# EAGLE design Rx (EAGLE 9.6.2)
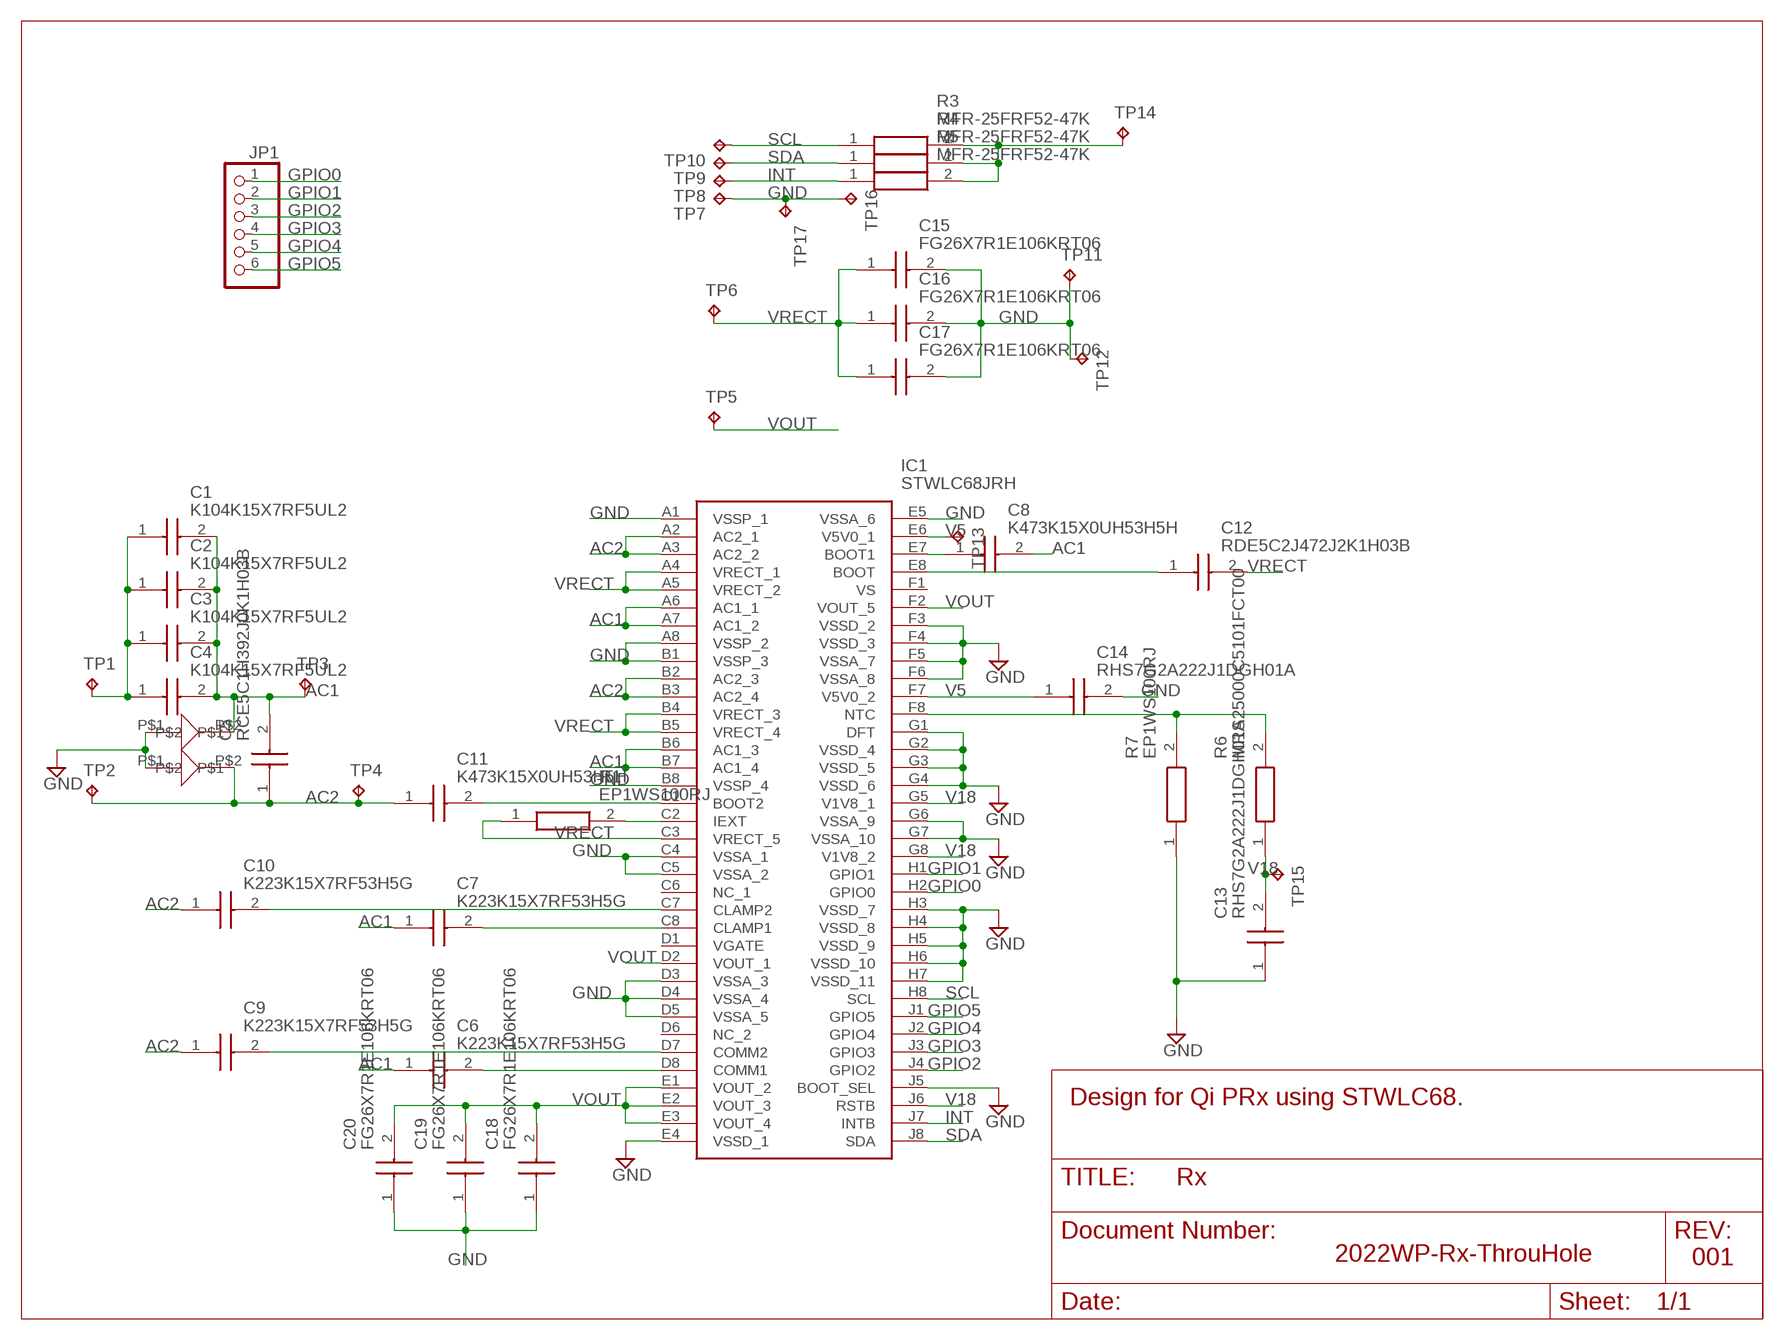
[diagram p0: schematic, sheet 1]

## Parts
C1  K104K15X7RF5UL2  [K104K15X7RF5UL2]
C2  K104K15X7RF5UL2  [K104K15X7RF5UL2]
C3  K104K15X7RF5UL2  [K104K15X7RF5UL2]
C4  K104K15X7RF5UL2  [K104K15X7RF5UL2]
C5  RCE5C1H392J0K1H03B  [RCER71H104K0K1H03B]
C6  K223K15X7RF53H5G  [K223K15X7RF53H5G]
C7  K223K15X7RF53H5G  [K223K15X7RF53H5G]
C8  K473K15X0UH53H5H  [K473K15X0UH53H5H]
C9  K223K15X7RF53H5G  [K223K15X7RF53H5G]
C10  K223K15X7RF53H5G  [K223K15X7RF53H5G]
C11  K473K15X0UH53H5H  [K473K15X0UH53H5H]
C12  RDE5C2J472J2K1H03B  [RCE5C1H104J2A2H03B]
C13  RHS7G2A222J1DGH01A  [RHS7G2A182J1A2H01B]
C14  RHS7G2A222J1DGH01A  [RHS7G2A182J1A2H01B]
C15  FG26X7R1E106KRT06  [FG26]
C16  FG26X7R1E106KRT06  [FG26]
C17  FG26X7R1E106KRT06  [FG26]
C18  FG26X7R1E106KRT06  [FG26]
C19  FG26X7R1E106KRT06  [FG26]
C20  FG26X7R1E106KRT06  [FG26]
IC1  STWLC68JRH  [BGA72C40P9X9_441X376X58]
JP1  PINHD-1X6  [1X06]
R1  EP1WS100RJ  [RESAD2400W54L1000D350]
R3  MFR-25FRF52-47K  [RESAD1590W60L630D240]
R4  MFR-25FRF52-47K  [RESAD1590W60L630D240]
R5  MFR-25FRF52-47K  [RESAD1590W60L630D240]
R6  MRS25000C5101FCT00  [RESAD1650W60L650D250]
R7  EP1WS100RJ  [RESAD2400W54L1000D350]
TP1  TPPAD1-13  [P1-13]
TP2  TPPAD1-13  [P1-13]
TP3  TPPAD1-13  [P1-13]
TP4  TPPAD1-13  [P1-13]
TP5  TPPAD1-13  [P1-13]
TP6  TPPAD1-13  [P1-13]
TP7  TPPAD1-13  [P1-13]
TP8  TPPAD1-13  [P1-13]
TP9  TPPAD1-13  [P1-13]
TP10  TPPAD1-13  [P1-13]
TP11  TPPAD1-13  [P1-13]
TP12  TPPAD1-13  [P1-13]
TP13  TPPAD1-13  [P1-13]
TP14  TPPAD1-13  [P1-13]
TP15  TPPAD1-13  [P1-13]
TP16  TPPAD1-13  [P1-13]
TP17  TPPAD1-13  [P1-13]
U$1  SA16A-E3/54  [SA16A-E3/54]
U$2  SA16A-E3/54  [SA16A-E3/54]

## Nets
AC1: C1.2 C2.2 C3.2 C4.2 C5.2 C6.1 C7.1 C8.2 IC1.A6(AC1_1) IC1.A7(AC1_2) IC1.B6(AC1_3) IC1.B7(AC1_4) TP3.TP U$1.P$2
AC2: C5.1 C9.1 C10.1 C11.1 IC1.A2(AC2_1) IC1.A3(AC2_2) IC1.B2(AC2_3) IC1.B3(AC2_4) TP2.TP TP4.TP U$2.P$2
GND: C13.1 C14.2 C15.2 C16.2 C17.2 C18.1 C19.1 C20.1 IC1.A1(VSSP_1) IC1.A8(VSSP_2) IC1.B1(VSSP_3) IC1.B8(VSSP_4) IC1.C4(VSSA_1) IC1.C5(VSSA_2) IC1.D3(VSSA_3) IC1.D4(VSSA_4) IC1.D5(VSSA_5) IC1.E4(VSSD_1) IC1.E5(VSSA_6) IC1.F3(VSSD_2) IC1.F4(VSSD_3) IC1.F5(VSSA_7) IC1.F6(VSSA_8) IC1.G1(DFT) IC1.G2(VSSD_4) IC1.G3(VSSD_5) IC1.G4(VSSD_6) IC1.G6(VSSA_9) IC1.G7(VSSA_10) IC1.H3(VSSD_7) IC1.H4(VSSD_8) IC1.H5(VSSD_9) IC1.H6(VSSD_10) IC1.H7(VSSD_11) IC1.J5(BOOT_SEL) R7.1 TP7.TP TP11.TP TP12.TP TP16.TP TP17.TP U$1.P$1 U$2.P$1
GPIO0: IC1.H2(GPIO0) JP1.1
GPIO1: IC1.H1(GPIO1) JP1.2
GPIO2: IC1.J4(GPIO2) JP1.3
GPIO3: IC1.J3(GPIO3) JP1.4
GPIO4: IC1.J2(GPIO4) JP1.5
GPIO5: IC1.J1(GPIO5) JP1.6
INT: IC1.J7(INTB) R5.1 TP8.TP
N$1: C6.2 IC1.D8(COMM1)
N$2: C7.2 IC1.C8(CLAMP1)
N$3: C8.1 IC1.E7(BOOT1)
N$4: C1.1 C2.1 C3.1 C4.1 TP1.TP
N$5: C11.2 IC1.C1(BOOT2)
N$6: C10.2 IC1.C7(CLAMP2)
N$7: C9.2 IC1.D7(COMM2)
N$8: C12.1 IC1.E8(BOOT)
N$9: IC1.C2(IEXT) R1.2
N$10: IC1.F8(NTC) R6.2 R7.2
N$11: R3.2 R4.2 R5.2 TP14.TP
SCL: IC1.H8(SCL) R3.1 TP10.TP
SDA: IC1.J8(SDA) R4.1 TP9.TP
V5: C14.1 IC1.E6(V5V0_1) IC1.F7(V5V0_2) TP13.TP
V18: C13.2 IC1.G5(V1V8_1) IC1.G8(V1V8_2) IC1.J6(RSTB) R6.1 TP15.TP
VOUT: C18.2 C19.2 C20.2 IC1.D2(VOUT_1) IC1.E1(VOUT_2) IC1.E2(VOUT_3) IC1.E3(VOUT_4) IC1.F2(VOUT_5) TP5.TP
VRECT: C12.2 C15.1 C16.1 C17.1 IC1.A4(VRECT_1) IC1.A5(VRECT_2) IC1.B4(VRECT_3) IC1.B5(VRECT_4) IC1.C3(VRECT_5) R1.1 TP6.TP
Unconnected: IC1.C6(NC_1) IC1.D1(VGATE) IC1.D6(NC_2) IC1.F1(VS)

## Notes on the sheet
- Design for Qi PRx using STWLC68.
- 2022WP-Rx-ThrouHole | 001

## Library data of the parts
C1-C4 = SamacSys_Parts:K104K15X7RF5UL2: Cap Ceramic 0.1uF 50V X7R 10% Radial 2.5mm 125C Ammo Source: Datasheet <https://www.vishay.com/doc?45233>; DESCRIPTION: Cap Ceramic 0.1uF 50V X7R 10% Radial 2.5mm 125C Ammo; HEIGHT: 5.4mm; MANUFACTURER_NAME: Vishay; MANUFACTURER_PART_NUMBER: K104K15X7RF5UL2; MOUSER_PART_NUMBER: 594-K104K15X7RF5UL2; MOUSER_PRICE-STOCK: https://www.mouser.co.uk/ProductDetail/Vishay-BC-Components/K104K15X7RF5UL2?qs=rLgk8CAOBHbCqsnkGO2HJA%3D%3D
C5 = SamacSys_Parts:RCE5C1H392J0K1H03B: Capacitor L=3.6mm W=3.5mm T=2.5mm Source: Datasheet <https://psearch.en.murata.com/capacitor/product/RCE5C1H392J0K1H03B.html>; DESCRIPTION: Capacitor L=3.6mm W=3.5mm T=2.5mm; HEIGHT: 5mm; MANUFACTURER_NAME: Murata Electronics; MANUFACTURER_PART_NUMBER: RCE5C1H392J0K1H03B
C6 C7 C9 C10 = SamacSys_Parts:K223K15X7RF53H5G: Multilayer Ceramic Capacitors MLCC - Leaded 50V 22nF 10% X7R e3 Auto Source: Datasheet <https://www.vishay.com/docs/45250/kgseries.pdf>; DESCRIPTION: Multilayer Ceramic Capacitors MLCC - Leaded 50V 22nF 10% X7R e3 Auto; HEIGHT: 6.4mm; MANUFACTURER_NAME: Vishay; MANUFACTURER_PART_NUMBER: K223K15X7RF53H5G; MOUSER_PART_NUMBER: 594-K223K15X7RF53H5G; MOUSER_PRICE-STOCK: https://www.mouser.co.uk/ProductDetail/Vishay-BC-Components/K223K15X7RF53H5G?qs=DPoM0jnrROXnwHVP6zMfDA%3D%3D
C8 C11 = SamacSys_Parts:K473K15X0UH53H5H: Vishay K473K15X0UH53H5H 47nF Multilayer Ceramic Capacitor MLCC 100V dc +/-10% Tolerance Through Hole Source: Datasheet <https://www.vishay.com/doc?45211>; DESCRIPTION: Vishay K473K15X0UH53H5H 47nF Multilayer Ceramic Capacitor MLCC 100V dc +/-10% Tolerance Through Hole; HEIGHT: 6.4mm; MANUFACTURER_NAME: Vishay; MANUFACTURER_PART_NUMBER: K473K15X0UH53H5H; MOUSER_PART_NUMBER: 594-K473K15X0UH53H5H; MOUSER_PRICE-STOCK: https://www.mouser.co.uk/ProductDetail/Vishay-BC-Components/K473K15X0UH53H5H?qs=HxuBozqkfXB1XV2ITKZqsg%3D%3D
C12 = SamacSys_Parts:RDE5C2J472J2K1H03B: Capacitor L=5.5mm W=4.0mm T=3.15mm Source: Datasheet <https://psearch.en.murata.com/capacitor/product/RDE5C2J472J2K1H03B.html>; DESCRIPTION: Capacitor L=5.5mm W=4.0mm T=3.15mm; HEIGHT: 5.5mm; MANUFACTURER_NAME: Murata Electronics; MANUFACTURER_PART_NUMBER: RDE5C2J472J2K1H03B; MOUSER_PART_NUMBER: 81-RDE5C2J472J2K1H3B; MOUSER_PRICE-STOCK: https://www.mouser.co.uk/ProductDetail/Murata-Electronics/RDE5C2J472J2K1H03B?qs=B6kkDfuK7%2FDo49LMQH5C1A%3D%3D
C13 C14 = SamacSys_Parts:RHS7G2A222J1DGH01A: Capacitor L=4.2mm W=3.5mm T=2.8mm Source: Datasheet <https://componentsearchengine.com/Datasheets/1/RHS7G2A222J1DGH01A.pdf>; DESCRIPTION: Capacitor L=4.2mm W=3.5mm T=2.8mm; HEIGHT: 5.5mm; MANUFACTURER_NAME: Murata Electronics; MANUFACTURER_PART_NUMBER: RHS7G2A222J1DGH01A; MOUSER_PART_NUMBER: 81-RHS7G2A222J1DGH1A; MOUSER_PRICE-STOCK: https://www.mouser.com/Search/Refine.aspx?Keyword=81-RHS7G2A222J1DGH1A
C15-C20 = SamacSys_Parts:FG26X7R1E106KRT06: MLCC with Dipped Radial Lead, Capacitance=10?F, LxWxT:5.5x6x3.5mm, Lead pitch:5mm Source: Datasheet <https://product.tdk.com/system/files/dam/doc/product/capacitor/ceramic/lead-mlcc/catalog/leadmlcc_halogenfree_fg_en.pdf>; DESCRIPTION: MLCC with Dipped Radial Lead, Capacitance=10?F, LxWxT:5.5x6x3.5mm, Lead pitch:5mm; HEIGHT: 6mm; MANUFACTURER_NAME: TDK; MANUFACTURER_PART_NUMBER: FG26X7R1E106KRT06; MOUSER_PART_NUMBER: 810-FG26X7R1E106KRT6; MOUSER_PRICE-STOCK: https://www.mouser.co.uk/ProductDetail/TDK/FG26X7R1E106KRT06?qs=qf2ddTMq67Uj8zbJHhN20w%3D%3D
IC1 = SamacSys_Parts:STWLC68JRH: Wireless Charging ICs Qi-compliant inductive wireless power receiver for 5W applications Source: Datasheet <https://componentsearchengine.com/Datasheets/1/STWLC68JRH.pdf>; DESCRIPTION: Wireless Charging ICs Qi-compliant inductive wireless power receiver for 5W applications; HEIGHT: 0.585mm; MANUFACTURER_NAME: STMicroelectronics; MANUFACTURER_PART_NUMBER: STWLC68JRH; MOUSER_PART_NUMBER: 511-STWLC68JRH; MOUSER_PRICE-STOCK: https://www.mouser.co.uk/ProductDetail/STMicroelectronics/STWLC68JRH?qs=GBLSl2AkirtnTJOZ01bmug%3D%3D
JP1 = pinhead:PINHD-1X6: PIN HEADER
R1 R7 = SamacSys_Parts:EP1WS100RJ: Res Wirewound 100 Ohm 5% 1W +/-300ppm/C Epoxy Resin AXL Ammo Source: Datasheet <https://datasheet.datasheetarchive.com/originals/dk/DKDS42/DSANUWW0051952.pdf?hkey=EF798316E3902B6ED9A73243A3159BB0>; DESCRIPTION: Res Wirewound 100 Ohm 5% 1W +/-300ppm/C Epoxy Resin AXL Ammo; HEIGHT: mm; MANUFACTURER_NAME: TE Connectivity; MANUFACTURER_PART_NUMBER: EP1WS100RJ; MOUSER_PART_NUMBER: 279-EP1WS100RJ; MOUSER_PRICE-STOCK: https://www.mouser.co.uk/ProductDetail/TE-Connectivity-Holsworthy/EP1WS100RJ?qs=IXkKOuu5vnHCFSAdn3AY7A%3D%3D
R3-R5 = SamacSys_Parts:MFR-25FRF52-47K: Metal Film Resistors - Through Hole 47K OHM 1/4W 1% Source: Datasheet <https://componentsearchengine.com/Datasheets/1/MFR-25FRF52-47K.pdf>; DESCRIPTION: Metal Film Resistors - Through Hole 47K OHM 1/4W 1%; HEIGHT: mm; MANUFACTURER_NAME: KEMET; MANUFACTURER_PART_NUMBER: MFR-25FRF52-47K; MOUSER_PART_NUMBER: 603-MFR-25FRF52-47K; MOUSER_PRICE-STOCK: https://www.mouser.co.uk/ProductDetail/YAGEO/MFR-25FRF52-47K?qs=oAGoVhmvjhz6e9IcIGQT0Q%3D%3D
R6 = SamacSys_Parts:MRS25000C5101FCT00: Vishay MRS25 Series Axial Thin Film Resistor 5.1k +/-1% 0.6W +/-50ppm/C Source: Datasheet <https://componentsearchengine.com/Datasheets/1/MRS25000C5101FCT00.pdf>; DESCRIPTION: Vishay MRS25 Series Axial Thin Film Resistor 5.1k +/-1% 0.6W +/-50ppm/C; HEIGHT: mm; MANUFACTURER_NAME: Vishay; MANUFACTURER_PART_NUMBER: MRS25000C5101FCT00; MOUSER_PART_NUMBER: 594-MRS25000C5101FCT; MOUSER_PRICE-STOCK: https://www.mouser.com/Search/Refine.aspx?Keyword=594-MRS25000C5101FCT
TP1-TP17 = testpad:TP: Test pad
U$1 U$2 = SamacSys_Parts:SA16A-E3/54

## Board
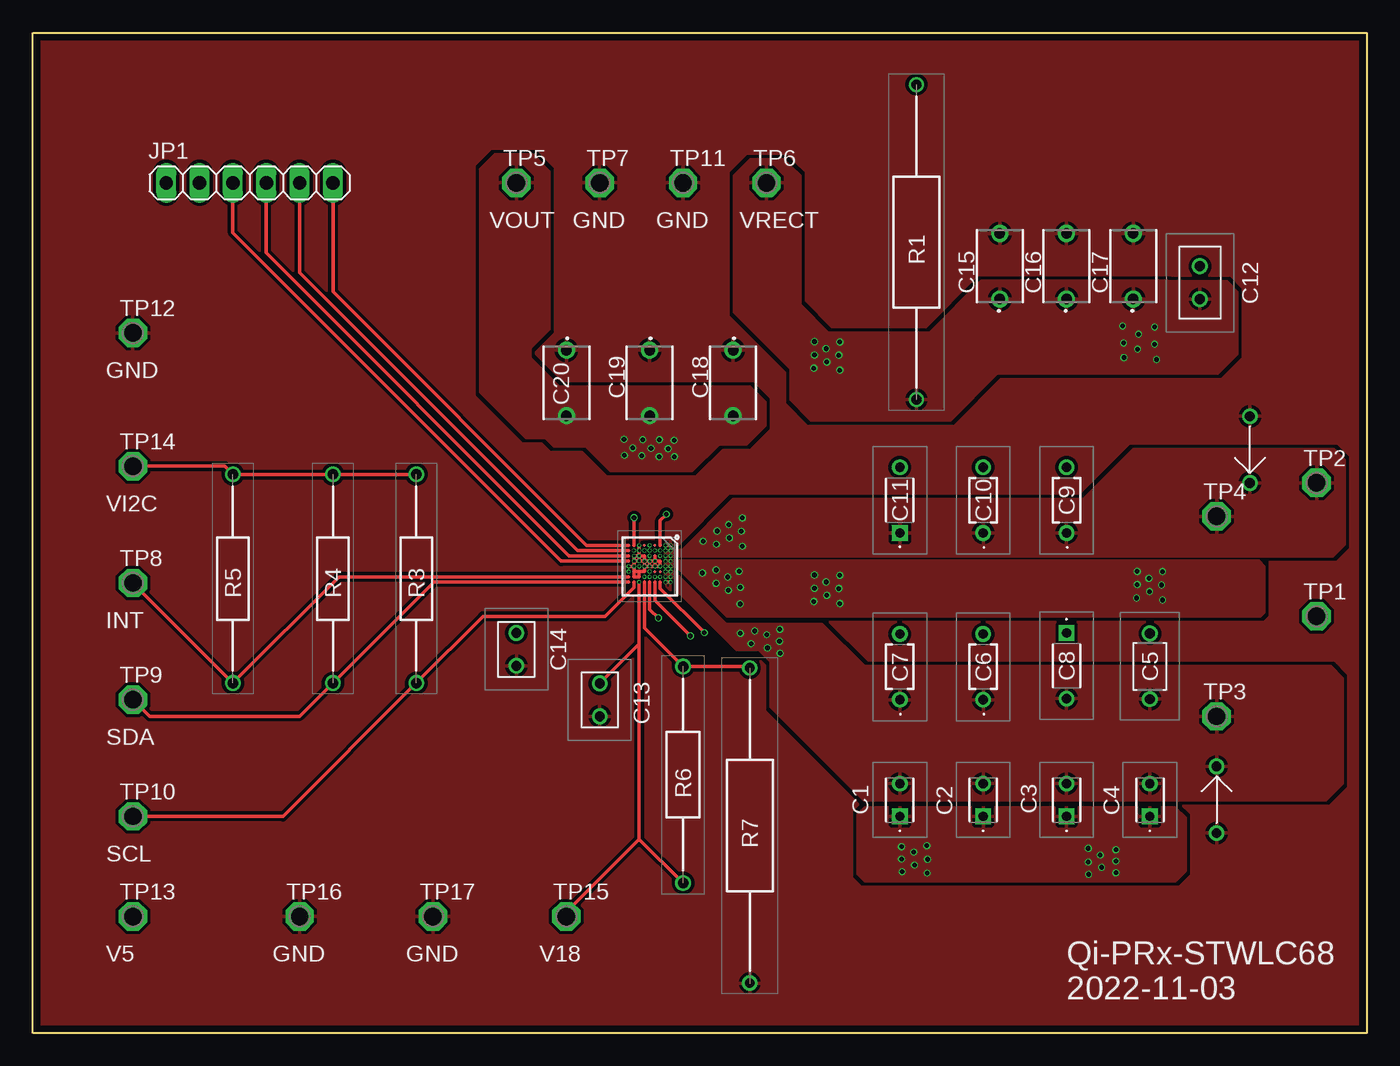
[diagram p1: board, top side]
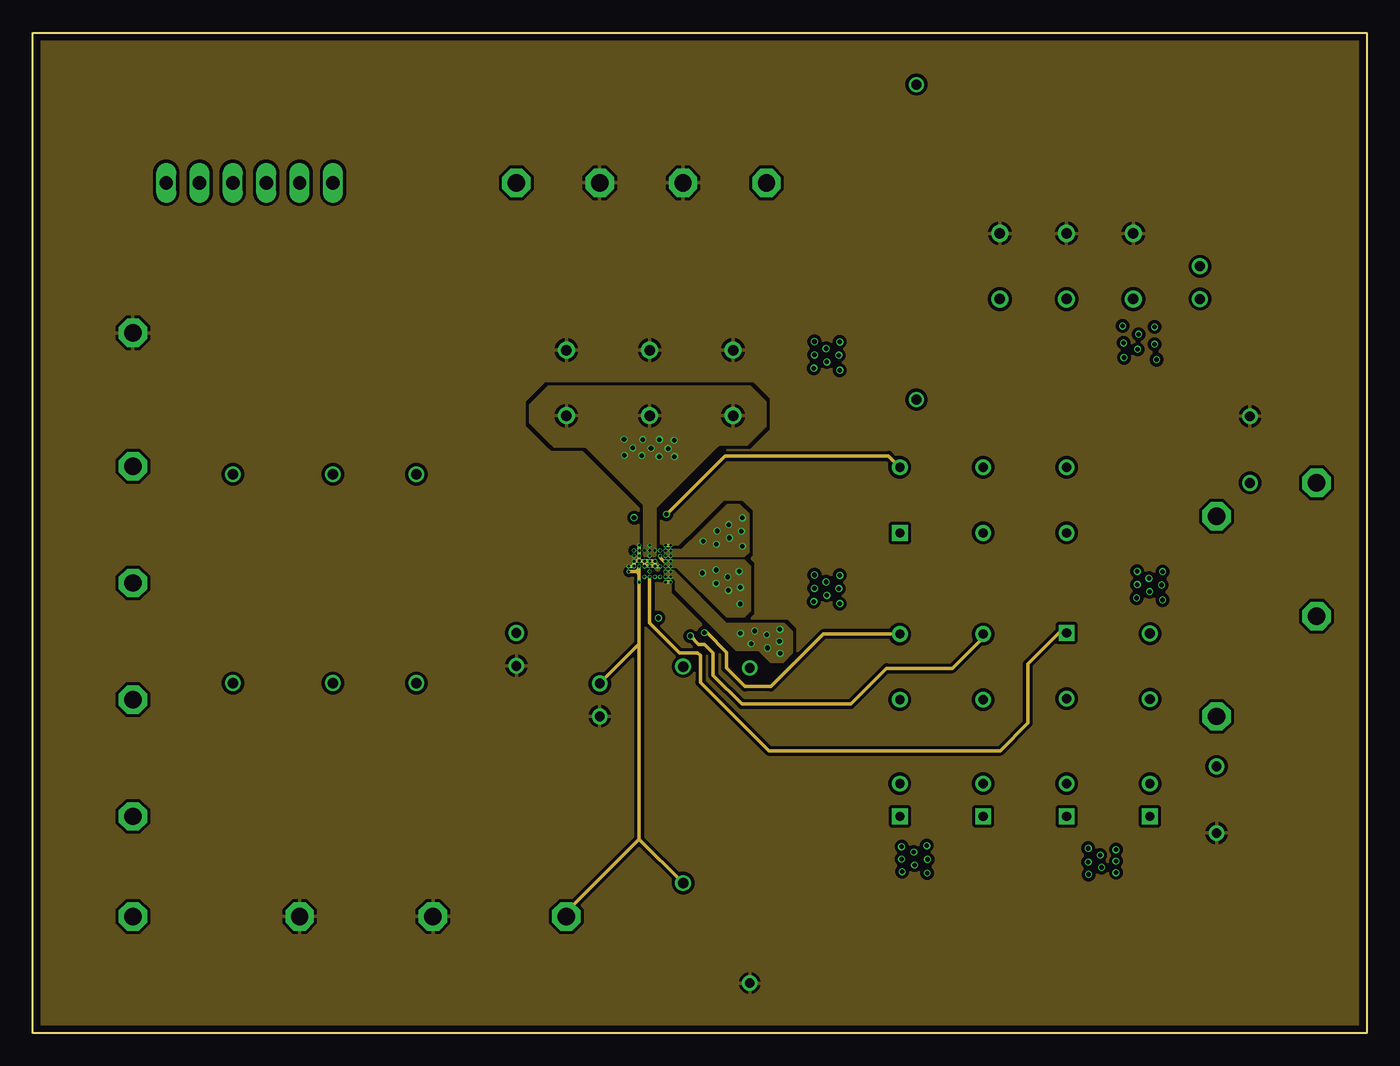
[diagram p2: board, inner layer Route2]
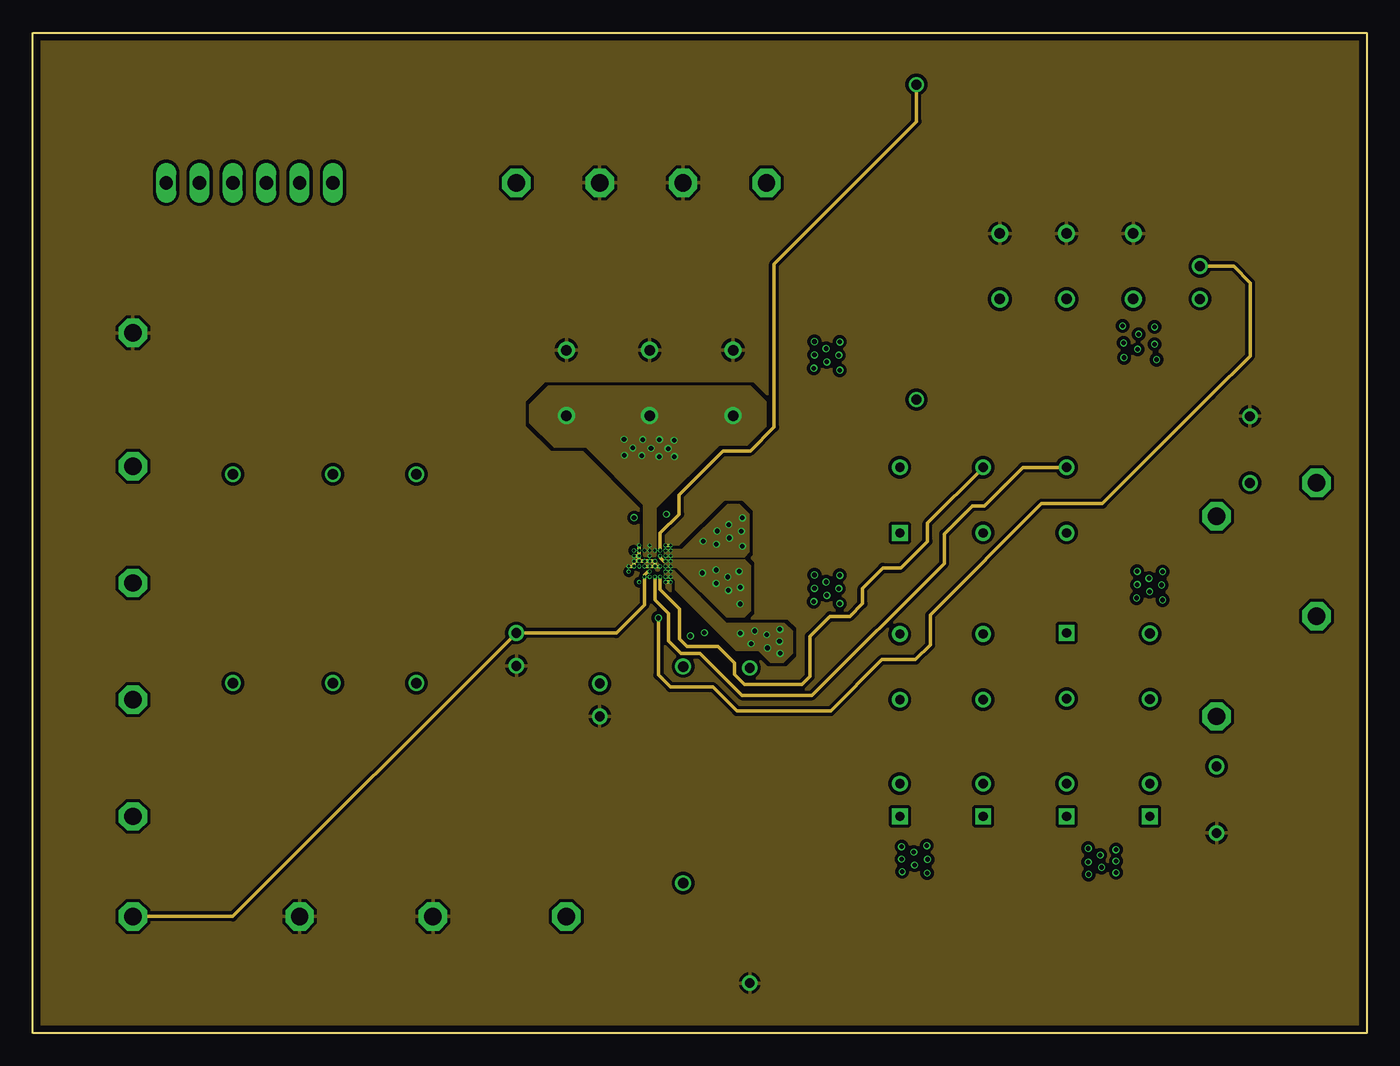
[diagram p3: board, inner layer Route15]
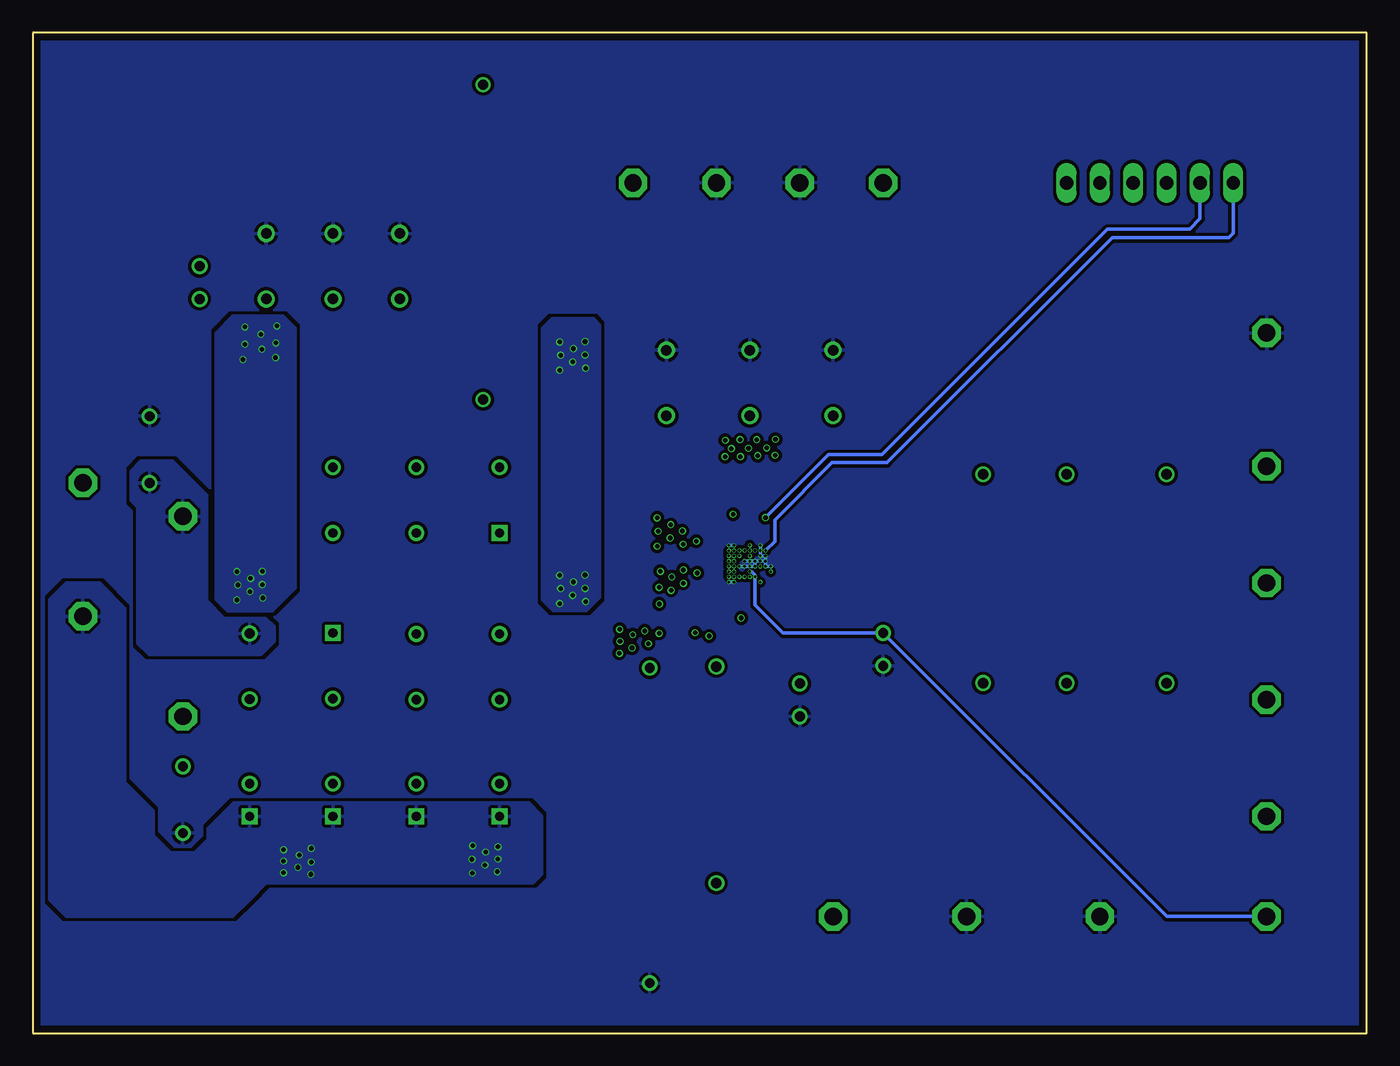
[diagram p4: board, bottom side, seen from below]

Size 101.6 x 76.2 mm. Coordinates in mm from the lower left corner, seen from the top.
Outline: 0,0 0,76.2 101.6,76.2 101.6,0 0,0
Copper layers (1+2*15+16): Top 0.0178mm / dielectric 12mil / Route2 0.0356mm / dielectric 28mil / Route15 0.0356mm / dielectric 12mil / Bottom 0.0178mm
Design rules "SSC-EAGLE-4Lyr_v1.0.0.3 *": minimum track width 6mil, minimum drill 4mil, track to track 4mil, track to pad 4mil, pad to pad 4mil, via to via 4mil, smd to smd 4mil, copper to edge 20mil, drill to drill 6mil, minimum pad ring 2mil, minimum via ring 2mil, stop-mask expansion 3mil, vias tented up to drill 0mil, thermal gap 10mil

### Footprints (pad centres in the part's own frame; a part is rotated, then mirrored left to right if it is on the bottom)
K104K15X7RF5UL2 = drill 0.7 pad 1.2 square: 1 0,0 | drill 0.7 pad 1.2: 2 2.5,0
RCER71H104K0K1H03B = drill 0.75 pad 1.2: 1 -2.5,0; 2 2.5,0
K223K15X7RF53H5G = drill 0.7 pad 1.2: 1 0,0; 2 5,0
K473K15X0UH53H5H = drill 0.7 pad 1.2 square: 1 0,0 | drill 0.7 pad 1.2: 2 5,0
RCE5C1H104J2A2H03B = drill 0.75 pad 1.2: 1 0,0; 2 2.5,0
RHS7G2A182J1A2H01B = drill 0.75 pad 1.2: 1 0,0; 2 2.5,0
FG26 = drill 0.8 pad 1.3: 1 -2.5,0; 2 2.5,0
BGA72C40P9X9_441X376X58 = smd 0.242 x 0.242: A1 -1.6,1.6; A2 -1.2,1.6; A3 -0.8,1.6; A4 -0.4,1.6; A5 0,1.6; A6 0.4,1.6; A7 0.8,1.6; A8 1.2,1.6; B1 -1.6,1.2; B2 -1.2,1.2; B3 -0.8,1.2; B4 -0.4,1.2; B5 0,1.2; B6 0.4,1.2; B7 0.8,1.2; B8 1.2,1.2; C1 -1.6,0.8; C2 -1.2,0.8; C3 -0.8,0.8; C4 -0.4,0.8; C5 0,0.8; C6 0.4,0.8; C7 0.8,0.8; C8 1.2,0.8; D1 -1.6,0.4; D2 -1.2,0.4; D3 -0.8,0.4; D4 -0.4,0.4; D5 0,0.4; D6 0.4,0.4; D7 0.8,0.4; D8 1.2,0.4; E1 -1.6,0; E2 -1.2,0; E3 -0.8,0; E4 -0.4,0; E5 0,0; E6 0.4,0; E7 0.8,0; E8 1.2,0; F1 -1.6,-0.4; F2 -1.2,-0.4; F3 -0.8,-0.4; F4 -0.4,-0.4; F5 0,-0.4; F6 0.4,-0.4; F7 0.8,-0.4; F8 1.2,-0.4; G1 -1.6,-0.8; G2 -1.2,-0.8; G3 -0.8,-0.8; G4 -0.4,-0.8; G5 0,-0.8; G6 0.4,-0.8; G7 0.8,-0.8; G8 1.2,-0.8; H1 -1.6,-1.2; H2 -1.2,-1.2; H3 -0.8,-1.2; H4 -0.4,-1.2; H5 0,-1.2; H6 0.4,-1.2; H7 0.8,-1.2; H8 1.2,-1.2; J1 -1.6,-1.6; J2 -1.2,-1.6; J3 -0.8,-1.6; J4 -0.4,-1.6; J5 0,-1.6; J6 0.4,-1.6; J7 0.8,-1.6; J8 1.2,-1.6
1X06 = drill 1.016 long: 1 -6.35,0; 2 -3.81,0; 3 -1.27,0; 4 1.27,0; 5 3.81,0; 6 6.35,0
RESAD2400W54L1000D350 = drill 0.75 pad 1.15: 1 0,0; 2 24,0
RESAD1590W60L630D240 = drill 0.8 pad 1.2: 1 0,0; 2 15.9,0
RESAD1650W60L650D250 = drill 0.8 pad 1.2: 1 0,0; 2 16.5,0
P1-13 = drill 1.321 pad 2.159 octagon: TP 0,0
SA16A-E3/54 = drill 0.75 pad 1.2: P$1 -2.54,0; P$2 2.54,0

### Placement (x,y rotation side)
C1  66.04,16.51 90 top
C2  72.39,16.51 90 top
C3  78.74,16.51 90 top
C4  85.09,16.51 90 top
C5  85.09,27.94 270 top
C6  72.39,25.4 90 top
C7  66.04,25.4 90 top
C8  78.74,30.48 270 top
C9  78.74,38.1 90 top
C10  72.39,38.1 90 top
C11  66.04,38.1 90 top
C12  88.9,58.42 270 top
C13  43.18,24.13 90 top
C14  36.83,30.48 270 top
C15  73.66,58.42 90 top
C16  78.74,58.42 90 top
C17  83.82,58.42 90 top
C18  53.34,49.53 270 top
C19  46.99,49.53 270 top
C20  40.64,49.53 270 top
IC1  46.99,35.56 270 top
JP1  16.51,64.77 0 top
R1  67.31,48.26 90 top
R3  29.21,26.67 90 top
R4  22.86,26.67 90 top
R5  15.24,26.67 90 top
R6  49.53,11.43 90 top
R7  54.61,3.81 90 top
TP1  97.79,31.75 0 top
TP2  97.79,41.91 0 top
TP3  90.17,24.13 0 top
TP4  90.17,39.37 0 top
TP5  36.83,64.77 0 top
TP6  55.88,64.77 0 top
TP7  43.18,64.77 0 top
TP8  7.62,34.29 0 top
TP9  7.62,25.4 0 top
TP10  7.62,16.51 0 top
TP11  49.53,64.77 0 top
TP12  7.62,53.34 0 top
TP13  7.62,8.89 0 top
TP14  7.62,43.18 0 top
TP15  40.64,8.89 0 top
TP16  20.32,8.89 0 top
TP17  30.48,8.89 0 top
U$1  90.17,17.78 90 top
U$2  92.71,44.45 270 top

### Tracks (layer width: path | path; a pad name or v marks a point on that pad's centre or on a via)
AC1  (via drill 0.2 pad 0.25, 0.35)
  Top 0.254: IC1.B6 | IC1.A6
  other vias: 48.19,35.16 48.59,35.16 48.59,34.76 48.19,34.76 56.9,30.76 56.87,29.84 54.99,30.63 55.91,30.35 54.71,29.67 55.96,29.34 53.9,30.45 56.92,28.93
  pour Top: 48.18,35.15 48.79,35.15 52.81,31.14 60.12,31.14 63.35,27.91 98.86,27.91 99.75,27.03 99.75,19.02 98.5,17.78 63.3,17.78 56.21,24.87 56.21,28.32 55.3,29.24 53.59,29.24 49.05,33.78 49.05,34.39 48.97,34.57 48.79,34.75 48.18,34.75
  pour Top (no thermals): 48.18,35.15 48.18,34.75 48.74,34.75 48.79,34.75 49,34.54 49,34.52 49,34.49 49.02,34.47 49.02,34.42 49.05,34.39 49.05,34.34 49.05,34.14 49.25,34.14 49.4,34.29 49.4,34.54 48.79,35.15
  pour Route2 (no thermals): 48.18,35.15 48.18,34.75 48.79,34.75 49.05,34.49 49.05,33.78 53.59,29.24 53.82,29.24 55.3,29.24 56.21,28.32 57.12,28.32 57.78,28.98 57.78,30.56 57.2,31.14 57.1,31.14 52.81,31.14 48.79,35.15
  pour Route15 (no thermals): 48.18,35.15 48.18,34.75 48.79,34.75 49.05,34.49 49.05,33.78 53.59,29.24 55.3,29.24 56.21,28.32 57.15,28.32 57.78,28.96 57.78,30.58 57.23,31.14 52.81,31.14 48.79,35.15
AC2  (via drill 0.2 pad 0.25, 0.35)
  Top 0.254: IC1.B2 | IC1.A2
  other vias: 48.19,36.76 48.59,36.76 48.59,36.36 48.19,36.36 54.05,39.24 53.98,38.23 51.05,37.47 53.01,38.73 52.12,38.25 53.06,37.72 52.07,37.24 54.05,37.08
  pour Top: 99.06,44.45 83.82,44.45 80.01,40.64 53.34,40.64 49.48,36.78 48.18,36.78 48.18,36.35 99.01,36.35 99.9,37.24 99.9,43.64 99.09,44.45
  pour Route2: 50.8,38.1 49.53,36.83 49.48,36.78 48.18,36.78 48.18,36.37 54.18,36.37 54.46,36.65 54.46,39.55 53.8,40.21 52.91,40.21
  pour Route15: 52.93,40.21 49.5,36.78 48.18,36.78 48.18,36.35 54.15,36.35 54.48,36.68 54.48,39.52 53.8,40.21
  pour Top (no thermals): 48.18,36.78 49.45,36.78 49.45,36.35 48.18,36.35
  pour Bottom: 83.24,30.94 83.24,29.82 84.23,28.83 92.74,28.83 93.6,29.69 93.6,40.08 94.11,40.59 94.11,42.82 93.37,43.56 90.93,43.56 89.59,42.21 88.37,41 88.37,37.16 88.37,32.94 87.02,31.6 83.87,31.6 83.24,30.96
GND  (via drill 0.2 pad 0.25)
  Top 0.254: IC1.B8 IC1.A8 | IC1.F5 v46.6,35.56 | IC1.E5 v46.99,35.57 | IC1.C5 | IC1.E4 | IC1.G4 | IC1.G2 | IC1.H6 IC1.H7 IC1.G7 IC1.G6 | IC1.H6 IC1.G6 | IC1.G6 IC1.F6 IC1.F5 | IC1.H6 IC1.H5 | IC1.H5 IC1.J5 | IC1.H5 IC1.H4 | IC1.H4 IC1.H3 IC1.G3 | IC1.G3 IC1.G4 | IC1.G4 IC1.H4 | IC1.G4 IC1.F4 | IC1.F4 IC1.F5 | IC1.E5 IC1.F5 | IC1.F4 IC1.E4 | IC1.E4 IC1.E5 | IC1.E5 IC1.D5 | IC1.D5 IC1.C5 | IC1.C5 IC1.C4 IC1.D4 | IC1.D4 IC1.E4 | IC1.D4 IC1.D5 | IC1.D3 IC1.D4 | IC1.G3 IC1.G2 | IC1.G2 IC1.G1 | IC1.A1 IC1.B1 | IC1.F4 IC1.F3 IC1.G3
  Route2 0.254: IC1.B8 IC1.A8 | IC1.A1 IC1.B1 | IC1.G1 IC1.G2 IC1.G3 IC1.G4 | IC1.G4 IC1.H4 IC1.H5 IC1.J5 | IC1.G4 IC1.F4 | IC1.F4 v46.6,35.56 v46.6,35.57 v46.99,35.57 IC1.D5 | IC1.D5 IC1.C5 | IC1.D5 IC1.D4 IC1.E4 IC1.F4
  Route15 0.254: IC1.G2 | IC1.G2 IC1.G3 | IC1.G1 IC1.G2 | IC1.G3 IC1.H3 | IC1.G3 IC1.G4 | IC1.G4 IC1.H4 IC1.H5 IC1.J5 | IC1.G4 IC1.F4 IC1.E4 IC1.D4 IC1.D5 | IC1.C5 IC1.D5 | IC1.D5 IC1.E5 v46.99,35.57 IC1.E5 v46.6,35.56 | IC1.B8 IC1.A8 | IC1.A1 IC1.B1
  Bottom 0.254: IC1.F4 IC1.G4 IC1.H4 | IC1.F4 IC1.E4 IC1.D4 | IC1.H4 IC1.H3 IC1.G3 IC1.G2 IC1.G1 | IC1.F4 IC1.F5 v46.6,35.56 IC1.E5 v46.99,35.57 IC1.E5 IC1.D5 IC1.C5 | IC1.A8 IC1.B8 | IC1.A1 IC1.B1 | IC1.J5 IC1.H5 IC1.H4
  other vias: 48.19,37.16 48.59,37.16 48.19,34.36 48.59,34.36 45.79,35.56 45.39,35.56 47.39,35.56 47.79,35.56 47.39,35.96 46.99,35.96 46.59,35.96 46.19,35.96 45.79,35.96 46.19,36.36 45.79,36.36 46.19,36.76 46.19,37.16
  pour Top (isolate 0.254, rank 3): 0,0 101.6,0 101.6,76.2 0,76.2
  pour Route2 (isolate 0.254, rank 3): 0,0 101.6,0 101.6,76.2 0,76.2
  pour Route15 (isolate 0.254, rank 3): 0,0 101.6,0 101.6,76.2 0,76.2
  pour Bottom (isolate 0.254, rank 3): 0,0 101.6,0 101.6,76.2 0,76.2
GPIO0  (via drill 0.2 pad 0.25)
  Top 0.254: IC1.H2 v45.78,36.76
  Bottom 0.254: v45.78,36.76 45.09,37.46 45.09,39.09 40.72,43.46 36.52,43.46 19.38,60.6 10.49,60.6 10.16,60.94 JP1.1
GPIO1  (via drill 0.35)
  Top 0.254: IC1.H1 v45.79,39.26 v45.8,39.27
  Bottom 0.254: v45.8,39.27 41,44.07 36.91,44.07 19.74,61.24 13.49,61.24 12.7,62.03 JP1.2
GPIO2
  Top 0.254: IC1.J4 40.24,35.96 15.24,60.96 JP1.3
GPIO3
  Top 0.254: IC1.J3 40.86,36.36 17.78,59.44 JP1.4
GPIO4
  Top 0.254: IC1.J2 41.5,36.76 20.32,57.94 JP1.5
GPIO5
  Top 0.254: IC1.J1 42.19,37.16 22.86,56.49 JP1.6
INT
  Top 0.254: IC1.J7 23.33,34.76 R5.1 TP8.TP
N$1  (via drill 0.35)
  Top 0.254: IC1.D8 47.39,32.95 v50.09,30.25
  Route2 0.254: v50.09,30.25 50.72,29.62 51.16,29.62 51.82,28.96 51.82,27.25 54,25.07 62.31,25.07 65.02,27.79 70.03,27.79 72.39,30.15 C6.2
N$2  (via drill 0.35)
  Top 0.254: IC1.C8 47.79,33.87 v51.16,30.5
  Route2 0.254: C7.2 60.22,30.4 56.21,26.39 54.25,26.39 52.83,27.81 52.83,29.01 51.33,30.5 v51.16,30.5
N$3  (via drill 0.2 pad 0.25)
  Top 0.254: IC1.E7 v46.98,34.76
  Route2 0.254: v46.98,34.76 46.98,31.25 49.28,28.96 50.65,28.96 50.85,28.75 50.85,26.72 56.06,21.51 73.69,21.51 75.79,23.62 75.79,28.12 78.16,30.48 C8.1
N$4  (via drill 0.35)
  other vias: 66.17,14.2 66.17,13.26 66.22,12.29 67.16,12.8 67.11,13.79 68.1,14.27 68.15,13.23 68.12,12.19 80.39,14.07 80.39,13.03 80.42,12.09 81.41,12.62 81.31,13.56 82.5,13.97 82.5,13.11 82.5,12.22
  pour Top: 63.37,17.17 87,17.17 87.78,16.38 87.78,12.34 87.02,11.58 64.49,11.58 63.37,11.58 62.84,12.12 62.84,16.64
  pour Bottom: 96.52,34.29 99.06,34.29 100.33,33.02 100.33,10.16 99.06,8.89 87.63,8.89 86.36,8.89 85.09,10.16 83.82,11.43 63.5,11.43 62.84,12.09 62.84,16.56 63.8,17.53 86.31,17.53 88.24,15.6 88.24,14.76 89.26,13.74 91.11,13.74 92.43,15.06 92.43,16.94 94.59,19.1 94.59,32.36
N$5  (via drill 0.35)
  Top 0.254: IC1.C1 47.79,39.05 v48.26,39.52
  Route2 0.254: v48.26,39.52 52.7,43.97 65.17,43.97 C11.2
N$6  (via drill 0.2 pad 0.25)
  Top 0.254: IC1.C7
  Route15 0.254: IC1.C7 47.79,33.8 49.28,32.31 49.28,30.02 49.84,29.46 52.17,29.46 53.44,28.19 53.44,27.3 54.2,26.54 58.57,26.54 59.18,27.15 59.18,30.23 60.71,31.75 62.23,31.75 63.2,32.72 63.2,33.88 64.75,35.43 66.12,35.43 68.15,37.47 68.15,38.86 C10.2
  other vias: 47.79,34.76
N$7  (via drill 0.2 pad 0.25)
  Top 0.254: IC1.D7 v47.38,34.76
  Route15 0.254: C9.2 75.41,43.1 72.47,40.16 71.55,40.16 69.42,38.02 69.42,35.79 59.36,25.73 54.03,25.73 50.83,28.93 49.38,28.93 48.44,29.87 48.44,31.95 47.38,33.01 v47.38,34.76
N$8  (via drill 0.35)
  Top 0.254: IC1.E8 46.99,32.28 v47.65,31.62
  Route15 0.254: C12.1 91.47,58.42 92.73,57.15 92.73,51.59 89.74,48.59 81.48,40.34 76.83,40.34 68.35,31.85 68.35,29.57 67.23,28.45 64.69,28.45 60.78,24.54 53.62,24.54 51.79,26.36 48.56,26.36 47.65,27.28 v47.65,31.62
N$9  (via drill 0.2 pad 0.25)
  Top 0.254: IC1.C2
  Route15 0.254: IC1.C2 47.79,38.08 49.23,39.52 49.23,41 52.58,44.35 54.66,44.35 56.46,46.15 56.46,58.6 67.31,69.44 R1.2
  other vias: 47.79,36.76
N$10
  Top 0.254: IC1.F8 46.59,30.87 R6.2 54.49,27.93 R7.2
N$11
  Top 0.254: TP14.TP 14.63,43.18 R5.2 R4.2 R3.2
SCL
  Top 0.254: IC1.H8 45.79,33.95 43.59,31.75 34.29,31.75 R3.1 19.05,16.51 TP10.TP
SDA
  Top 0.254: IC1.J8 30.55,34.36 R4.1 20.32,24.13 8.89,24.13 TP9.TP
V5  (via drill 0.2 pad 0.25)
  Top 0.254: IC1.F7 v46.58,34.76 | IC1.E6
  Route15 0.254: IC1.E6 46.97,35.14 46.82,35.14 46.6,34.92 46.6,34.78 v46.58,34.76 46.58,32.61 44.45,30.48 C14.1 15.24,8.89 TP13.TP
  Bottom 0.254: IC1.E6 46.97,35.14 46.82,35.14 46.6,34.92 46.6,34.78 v46.58,34.76 46.58,32.61 44.45,30.48 C14.1 15.24,8.89 TP13.TP
  other vias: 46.99,35.16
V18  (via drill 0.2 pad 0.25)
  Top 0.254: IC1.G5 | IC1.J6 | IC1.G8 46.19,29.64 | 46.19,29.64 C13.2 | 46.19,29.64 46.19,14.77 | R6.1 46.19,14.77 | 46.19,14.77 40.64,9.22 TP15.TP
  Route2 0.254: IC1.G5 46.19,35.38 | 46.19,35.38 46.19,34.95 | 46.19,34.95 IC1.G8 46.19,29.64 | 46.19,29.64 C13.2 | 46.19,29.64 46.19,14.77 | R6.1 46.19,14.77 | 46.19,35.38 45.97,35.16 IC1.J6 45.98,35.16 46.19,34.95 | 46.19,14.77 40.64,9.22 TP15.TP
  other vias: 46.19,35.56 45.39,35.16 46.19,34.36
VOUT  (via drill 0.2 pad 0.25, 0.35)
  Top 0.254: IC1.D2 v47.38,36.76
  other vias: 46.59,36.76 46.99,36.36 46.99,36.76 46.99,37.16 45.03,45.24 45.69,44.58 46.46,45.21 45.06,44.02 46.38,43.99 47.7,43.92 47.09,44.55 47.73,45.21 48.84,45.16 48.39,44.53 48.87,43.92
  pour Route2: 46.58,37.16 46.58,36.37 47.4,36.37 47.4,40.03 51.92,44.55 52.25,44.88 54.38,44.88 55.75,46.25 55.75,48.08 54.61,49.23 39.29,49.23 37.92,47.85 37.92,46.51 39.45,44.98 39.73,44.7 42.14,44.7 46.58,40.26
  pour Route15 (no thermals): 46.58,37.16 46.58,36.37 47.4,36.37 47.4,40.03 52.25,44.88 54.38,44.88 55.75,46.25 55.75,48.08 54.61,49.23 39.29,49.23 37.92,47.85 37.92,46.51 39.73,44.7 42.16,44.7 46.58,40.28
  pour Top (no thermals): 39.29,49.23 54.61,49.23 55.75,48.08 55.75,46.28 54.36,44.88 52.25,44.88 50.22,42.85 43.99,42.85 42.14,44.7 39.73,44.7 39.7,44.73 37.92,46.51 37.92,47.85
  pour Top: 35.2,66.93 38.02,66.93 38.13,66.83 39.32,65.63 39.32,55.32 39.32,53.64 37.87,52.2 37.87,51.44 40.06,49.25 40.51,48.79 42.67,48.79 43.43,48.03 43.43,46.35 42.44,45.36 39.45,45.36 37.57,45.36 35.61,47.32 34.09,48.84 34.09,65.13 34.09,65.81
VRECT  (via drill 0.2 pad 0.25, 0.35)
  Top 0.254: IC1.B4 | IC1.A4 | IC1.C3
  Route2 0.254: IC1.C3 47.81,36.34 47.81,36.2 48.03,35.98 48.17,35.98 IC1.B4
  Route15 0.254: IC1.C3 47.81,36.34 47.81,36.2 48.03,35.98 48.17,35.98 IC1.B4
  other vias: 48.19,35.96 48.59,35.96 48.59,35.56 48.19,35.56 47.79,36.36 85.45,52.48 85.6,51.31 84.15,52.1 83.11,51.46 83.08,52.58 83.01,53.87 84.23,53.24 85.45,53.8 61.47,52.65 61.39,51.64 59.54,52.68 60.43,52.15 59.54,51.66 60.48,51.13 59.49,50.65 61.47,50.5 86.06,35.15 85.98,34.14 84.12,35.18 85.01,34.65 84.12,34.16 85.06,33.63 84.07,33.15 86.06,32.99 61.47,34.87 61.39,33.86 59.54,34.9 60.43,34.37 59.54,33.88 60.48,33.35 59.49,32.87 61.47,32.72 53.8,35.18 53.9,33.96 52.04,35.28 52.93,34.75 52.04,34.26 52.98,33.73 51,35.05 53.87,32.69
  pour Top: 48.18,35.97 93.37,35.97 93.78,35.56 93.78,32.05 93.5,31.78 52.86,31.78 49.07,35.56 48.18,35.56
  pour Route2: 48.18,35.97 48.18,35.56 49,35.56 49.07,35.56 52.86,31.78 54.18,31.78 54.58,32.18 54.58,35.56 54.18,35.97
  pour Route15: 48.18,35.97 48.18,35.56 49.07,35.56 52.86,31.78 54.18,31.78 54.58,32.18 54.58,35.59 54.2,35.97
  pour Top (no thermals): 48.18,35.97 48.18,35.56 49.07,35.56 49.07,35.97
  pour Bottom: 58.42,53.34 58.42,33.17 59.11,32.49 59.41,32.18 61.98,32.18 62.79,32.99 62.79,53.7 62.38,54.1 62.05,54.43 58.9,54.43 58.42,53.95
  pour Bottom: 82.55,54.61 86.36,54.61 87.63,53.34 87.63,33.02 86.77,32.16 83.39,32.16 81.64,33.91 81.64,52.81 81.64,53.7
  pour Top: 58.42,53.34 68.33,53.34 72.26,57.28 86.41,57.28 86.44,57.25 90.93,57.25 91.72,56.46 91.72,51.74 90.25,50.27 73.43,50.27 69.88,46.71 59.28,46.71 57.73,48.26 57.73,48.29 57.73,52.65
  pour Top: 54.66,66.55 57.18,66.55 57.71,66.01 58.42,65.3 58.42,55.5 60.58,53.34 62.38,53.34 62.89,52.83 62.89,50.39 61.95,49.45 58.9,49.45 57.73,50.62 53.44,54.91 53.44,65.15 53.44,65.33

### Text on the board
tNames: VOUT | GND | GND | VRECT | GND | VI2C | INT | SDA | SCL | V5 | GND | GND | V18 | Qi-PRx-STWLC68 / 2022-11-03